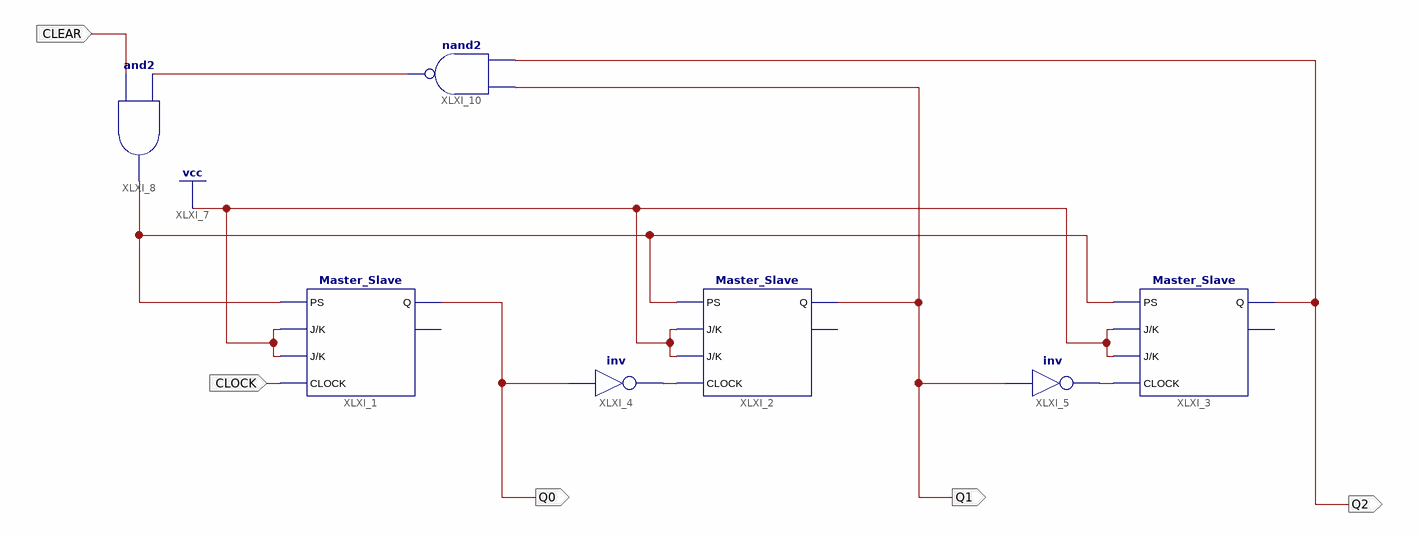
[diagram p0: schematic sheet 1]
// Xilinx ISE schematic MOD_6_DOWN.sch (artix7) as structural Verilog: 7 symbols, 5 ports
module MOD_6_DOWN (
  input  CLEAR,
  input  CLOCK,
  output Q0,
  output Q1,
  output Q2
);

  wire XLXN_1, XLXN_2, XLXN_16, XLXN_19;

  Master_Slave XLXI_1 (.CLOCK(CLOCK), .J(1'b1), .K(1'b1), .PS(XLXN_19), .Q(Q0));  // open: Qb
  Master_Slave XLXI_2 (.CLOCK(XLXN_1), .J(1'b1), .K(1'b1), .PS(XLXN_19), .Q(Q1));  // open: Qb
  Master_Slave XLXI_3 (.CLOCK(XLXN_2), .J(1'b1), .K(1'b1), .PS(XLXN_19), .Q(Q2));  // open: Qb
  not XLXI_4 (XLXN_1, Q0);
  not XLXI_5 (XLXN_2, Q1);
  and XLXI_8 (XLXN_19, CLEAR, XLXN_16);
  nand XLXI_10 (XLXN_16, Q2, Q1);
endmodule
